# Altium schematic sheet JacdacPowerUsbC4PortShared 31.SchDoc: complete design
size A3; DocumentNumber: 1; SheetNumber: 1; SheetTotal: 1; VersionControl_RevNumber: 1
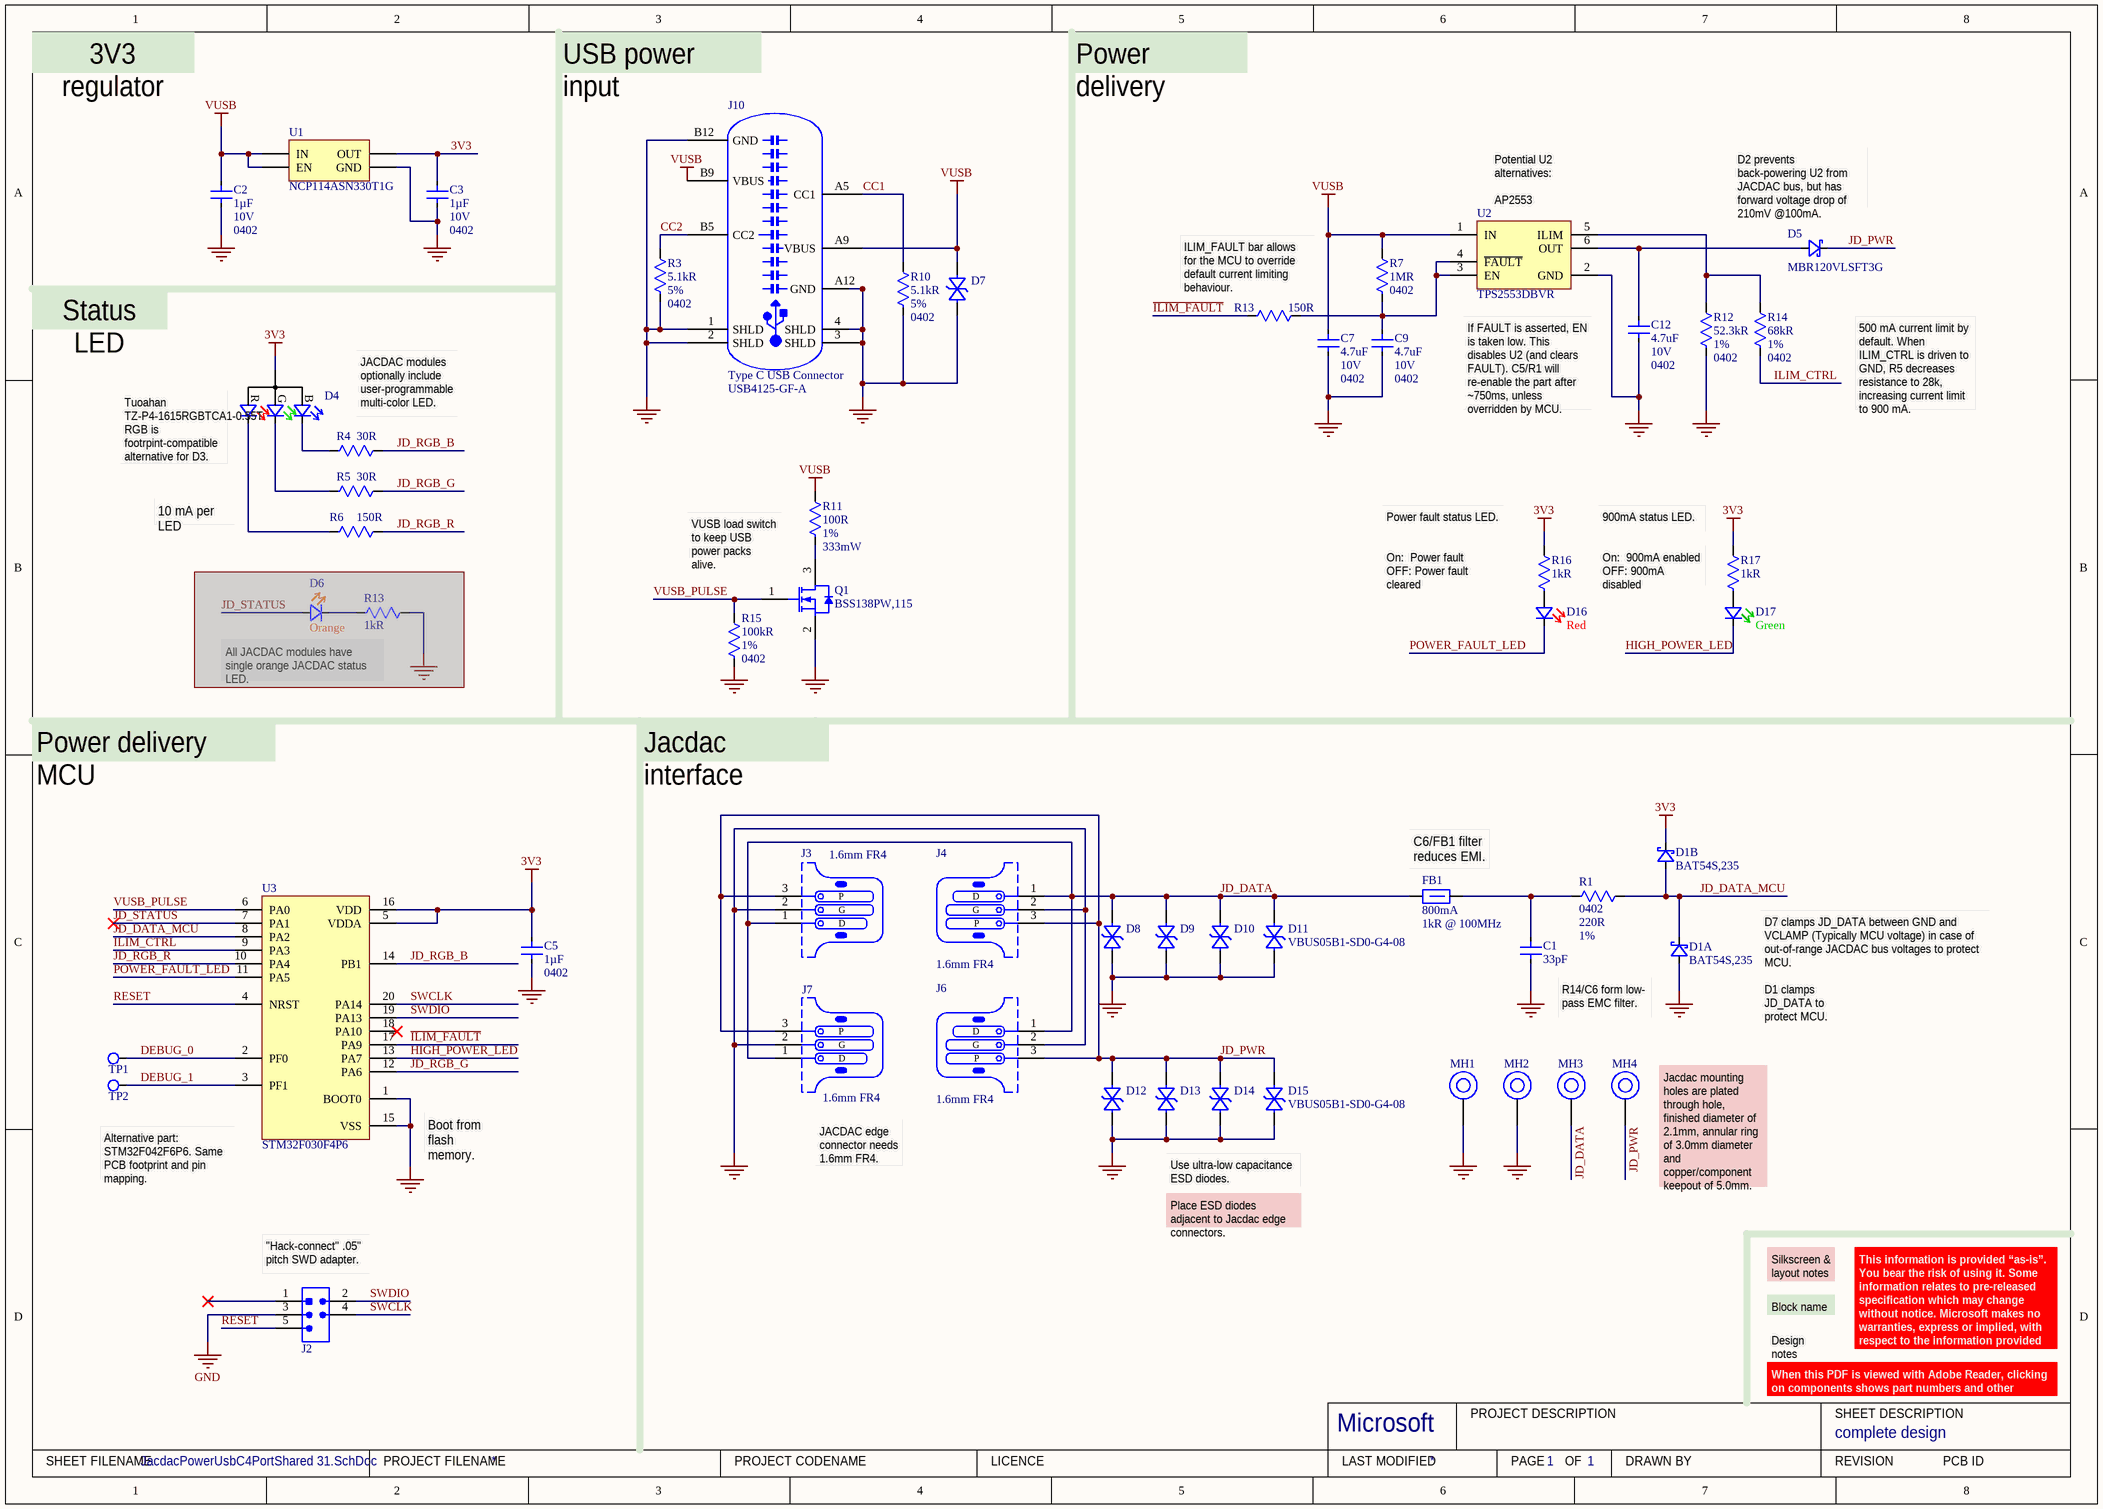
[diagram p0: JacdacPowerUsbC4PortShared 31.SchDoc]

## Parts
(Parts that share a designator on the sheet are numbered #1, #2 ... from top to bottom, then left to right.)
C1  Capacitance: 33pF  [C0402_0.55MM - without outline]  (hidden comment: CL05C330JB51PNC)
C2  Capacitance: 1µF  Voltage Rating: 10V  Case Code (Imperial): 0402  [C0402_0.55MM - without outline]  (hidden comment: CL05A105KP5NNNC)
C3  Capacitance: 1µF  Voltage Rating: 10V  Case Code (Imperial): 0402  [C0402_0.55MM - without outline]  (hidden comment: CL05A105KP5NNNC)
C5  Capacitance: 1µF  Case Code (Imperial): 0402  [C0402_0.55MM - without outline]  (hidden comment: CL05A105KP5NNNC)
C7  Capacitance: 4.7uF  Voltage Rating: 10V  Case Code (Imperial): 0402  [R0402 - Without outline]  (hidden comment: CL05A475MP5NRNC)
C9  Capacitance: 4.7uF  Voltage Rating: 10V  Case Code (Imperial): 0402  [R0402 - Without outline]  (hidden comment: CL05A475MP5NRNC)
C12  Capacitance: 4.7uF  Voltage Rating: 10V  Case Code (Imperial): 0402  [R0402 - Without outline]  (hidden comment: CL05A475MP5NRNC)
D1  Manufacturer Part Number: BAT54S,235  [NXP-BAT54S-TO-236AB - without outline]  (hidden comment: BAT54S)  (parts A,B of 2)
D4  HSMF-C114  [HSMF-C114]  (value not drawn)
D5  MBR120VLSFT3G  [MBR120VLSFT3G]
D6  Colour: Orange  [Rohm SML-D12 Orange - without outline]  (hidden comment: SML-D12D)  (masked out: inside a compile mask, not in the netlist)
D7  VBUS05B1-SD0-G4-08  [0201-VBUS05B1-SD0-G4-08 - Without outline]  (value not drawn)
D8  VBUS05B1-SD0-G4-08  [0201-VBUS05B1-SD0-G4-08 - Without outline]  (value not drawn)
D9  VBUS05B1-SD0-G4-08  [0201-VBUS05B1-SD0-G4-08 - Without outline]  (value not drawn)
D10  VBUS05B1-SD0-G4-08  [0201-VBUS05B1-SD0-G4-08 - Without outline]  (value not drawn)
D11  VBUS05B1-SD0-G4-08  [0201-VBUS05B1-SD0-G4-08 - Without outline]
D12  VBUS05B1-SD0-G4-08  [0201-VBUS05B1-SD0-G4-08 - Without outline]  (value not drawn)
D13  VBUS05B1-SD0-G4-08  [0201-VBUS05B1-SD0-G4-08 - Without outline]  (value not drawn)
D14  VBUS05B1-SD0-G4-08  [0201-VBUS05B1-SD0-G4-08 - Without outline]  (value not drawn)
D15  VBUS05B1-SD0-G4-08  [0201-VBUS05B1-SD0-G4-08 - Without outline]
D16  Colour: Red  [Rohm SML-D12 Red - without outline]  (hidden comment: SML-D12U)
D17  Colour: Green  [Rohm SML-D12 Green - without outline]  (hidden comment: SML-D12P)
FB1  Current Rating: 800mA  Impedance: 1kR @ 100MHz  [TDK MPZ1608 0.8mm - without outline]  (hidden comment: TDK MPZ1608S102ATA00)
J2  Hack Connect Mini 1.27 mm pitch 2-row  [HACK_CONNECT_MINI_5_X_1_27]  (value not drawn)  (no BOM)
J3  PCB Type: 1.6mm FR4  [JACDAC_EDGE_CONNECTOR]  (hidden comment: 3 pin jacdac edge connector)  (no BOM)
J4  PCB Type: 1.6mm FR4  [JACDAC_EDGE_CONNECTOR]  (hidden comment: 3 pin jacdac edge connector)  (no BOM)
J6  PCB Type: 1.6mm FR4  [JACDAC_EDGE_CONNECTOR]  (hidden comment: 3 pin jacdac edge connector)  (no BOM)
J7  PCB Type: 1.6mm FR4  [JACDAC_EDGE_CONNECTOR]  (hidden comment: 3 pin jacdac edge connector)  (no BOM)
J10  Type C USB Connector  [USB4125-GF-A]
MH1  MH_5.0MMK_3.0MMC_2.1MMD_PTH  [MH_5.0MMK_3.0MMC_2.1MMD_PTH]  (value not drawn)  (no BOM)
MH2  MH_5.0MMK_3.0MMC_2.1MMD_PTH  [MH_5.0MMK_3.0MMC_2.1MMD_PTH]  (value not drawn)  (no BOM)
MH3  MH_5.0MMK_3.0MMC_2.1MMD_PTH  [MH_5.0MMK_3.0MMC_2.1MMD_PTH]  (value not drawn)  (no BOM)
MH4  MH_5.0MMK_3.0MMC_2.1MMD_PTH  [MH_5.0MMK_3.0MMC_2.1MMD_PTH]  (value not drawn)  (no BOM)
Q1  BSS138PW,115  [SOT323 - without_outline]
R1  Case Code (Imperial): 0402  Resistance: 220R  Tolerance: 1%  [R0402 - Without outline]  (hidden comment: RC0402FR-07220RL)
R3  Resistance: 5.1kR  Tolerance: 5%  Case Code (Imperial): 0402  [R0402 - Without outline]  (hidden comment: RC0402JR-075K1L)
R4  Resistance: 30R  [R0402 - Without outline]  (hidden comment: RC0402FR-0730RL)
R5  Resistance: 30R  [R0402 - Without outline]  (hidden comment: RC0402FR-0730RL)
R6  Resistance: 150R  [R0402 - Without outline]  (hidden comment: RC0402FR-07150RL)
R7  Resistance: 1MR  Case Code (Imperial): 0402  [R0402 - Without outline]
R10  Resistance: 5.1kR  Tolerance: 5%  Case Code (Imperial): 0402  [R0402 - Without outline]  (hidden comment: RC0402JR-075K1L)
R11  Resistance: 100R  Tolerance: 1%  Max Power Dissipation: 333mW  [RES0805]  (hidden comment: CRGP0805F100R)
R12  Resistance: 52.3kR  Tolerance: 1%  Case Code (Imperial): 0402  [R0402 - Without outline]  (hidden comment: RC0402FR-0752K3L)
R13#1  Resistance: 150R  [R0402 - Without outline]  (hidden comment: RC0402FR-07150RL)
R13#2  Resistance: 1kR  [R0402 - Without outline]  (hidden comment: RC0402FR-071KL)  (masked out: inside a compile mask, not in the netlist)
R14  Resistance: 68kR  Tolerance: 1%  Case Code (Imperial): 0402  [R0402 - Without outline]  (hidden comment: RT0402FRE0768KL)
R15  Resistance: 100kR  Tolerance: 1%  Case/Package: 0402  [R0402 - Without outline]  (hidden comment: RC0402FR-07100KL)
R16  Resistance: 1kR  [R0402 - Without outline]  (hidden comment: RC0402FR-071KL)
R17  Resistance: 1kR  [R0402 - Without outline]  (hidden comment: RC0402FR-071KL)
TP1  TestPoint  [Pad1.27mm]  (value not drawn)  (no BOM)
TP2  TestPoint  [Pad1.27mm]  (value not drawn)  (no BOM)
U1  LDO 3.3V/300 mA  [ON_SEMI-SOT23-5 - without outline]  (value not drawn)
U2  TPS2553DBVR  [TI-TPS2553 - without_outline]
U3  STM32F030F4P6  [20-TSSOP - without outline]

## Nets
3V3: C3.2 C5.2 D1.2(K) D4.1(A) R16.1 R17.1 U1.5(OUT) U3.5(VDDA) U3.16(VDD)
GND: C1.1 C2.1 C3.1 C5.1 C7.1 C9.1 C12.1 D1.1(A) D7.2(A) D8.2(A) D9.2(A) D10.2(A) D11.2(A) D12.2(A) D13.2(A) D14.2(A) D15.2(A) J2.3(GND) J3.2(G) J4.2(G) J6.2(G) J7.2(G) J10.1(SHLD) J10.2(SHLD) J10.3(SHLD) J10.4(SHLD) J10.A12(GND) J10.B12(GND) MH1.1 MH2.1 Q1.2(S) R3.2 R10.2 R12.1 R15.1 U1.2(GND) U2.2(GND) U3.1(BOOT0) U3.15(VSS)
VUSB: C2.2 C7.2 D7.1(K) J10.A9(VBUS) J10.B9(VBUS) R7.1 R11.2 U1.1(IN) U1.3(EN) U2.1(IN)
~{ILIM_FAULT}: R13#1.1 U3.17(PA9)
CC1: J10.A5(CC1) R10.1
CC2: J10.B5(CC2) R3.1
DEBUG_0: TP1.1 U3.2(PF0)
DEBUG_1: TP2.1 U3.3(PF1)
HIGH_POWER_LED: D17.1(K) U3.13(PA7)
ILIM_CTRL: R14.1 U3.9(PA3)
JD_DATA: D8.1(K) D9.1(K) D10.1(K) D11.1(K) FB1.1 J3.1(D) J4.1(D) J6.1(D) J7.1(D) MH3.1
JD_DATA_MCU: D1.3(K) R1.1 U3.8(PA2)
JD_PWR: D5.1(K) D12.1(K) D13.1(K) D14.1(K) D15.1(K) J3.3(P) J4.3(P) J6.3(P) J7.3(P) MH4.1
JD_RGB_B: R4.2 U3.14(PB1)
JD_RGB_G: R5.2 U3.12(PA6)
JD_RGB_R: R6.2 U3.10(PA4)
JD_STATUS: U3.7(PA1)
POWER_FAULT_LED: D16.1(K) U3.11(PA5)
RESET: J2.5(RESET) U3.4(NRST)
SWCLK: J2.4(SWCLK) U3.20(PA14)
SWDIO: J2.2(SWDIO) U3.19(PA13)
VUSB_PULSE: Q1.1(G) R15.2 U3.6(PA0)
NetC1_2: C1.2 FB1.2 R1.2
NetC9_2: C9.2 R7.2 R13#1.2 U2.3(EN) U2.4(~{FAULT})
NetC12_2: C12.2 D5.2(A) U2.6(OUT)
NetD4_2: D4.2(R) R6.1
NetD4_3: D4.3(G) R5.1
NetD4_4: D4.4(B) R4.1
NetD16_2: D16.2(A) R16.2
NetD17_2: D17.2(A) R17.2
NetQ1_3: Q1.3(D) R11.1
NetR12_2: R12.2 R14.2 U2.5(ILIM)

Not connected (* = marked no-connect by the designer): J2 1(VCC)*; U3 18(PA10)*

## Notes on the sheet
- 3V3 regulator
- USB power input
- Power delivery
- (near U2) Potential U2 alternatives:
  AP2553
- (near D5) D2 prevents back-powering U2 from JACDAC bus, but has forward voltage drop of 210mV @100mA.
- (near R13#1) ILIM_FAULT bar allows for the MCU to override default current limiting behaviour.
- Status LED
- JACDAC modules optionally include user-programmable multi-color LED.
- If FAULT is asserted, EN is taken low. This disables U2 (and clears FAULT). C5/R1 will re-enable the part after ~750ms, unless overridden by MCU.
- 500 mA current limit by default. When ILIM_CTRL is driven to GND, R5 decreases resistance to 28k, increasing current limit to 900 mA.
- (near D4) Tuoahan TZ-P4-1615RGBTCA1-0.55T RGB is footrpint-compatible alternative for D3.
- 10 mA per LED
- VUSB load switch to keep USB power packs alive.
- (near R16) Power fault status LED.
- On:  Power fault                  OFF: Power fault cleared
- (near R17) 900mA status LED.
- On:  900mA enabled     OFF: 900mA disabled
- All JACDAC modules have single orange JACDAC status LED.
- Power delivery MCU
- Jacdac interface
- (near FB1) C6/FB1 filter reduces EMI.
- D7 clamps JD_DATA between GND and VCLAMP (Typically MCU voltage) in case of out-of-range JACDAC bus voltages to protect MCU.
- R14/C6 form low-
  pass EMC filter.
- D1 clamps JD_DATA to protect MCU.
- Alternative part: STM32F042F6P6. Same PCB footprint and pin mapping.
- Boot from flash memory.
- JACDAC edge connector needs 1.6mm FR4.
- Use ultra-low capacitance ESD diodes.
- (near MH4) Jacdac mounting holes are plated through hole, finished diameter of 2.1mm, annular ring of 3.0mm diameter and copper/component keepout of 5.0mm.
- Place ESD diodes adjacent to Jacdac edge connectors.
- (near J2) "Hack-connect" .05" pitch SWD adapter.
- Block name
- Silkscreen & layout notes
- Design notes
- When this PDF is viewed with Adobe Reader, clicking on components shows part numbers and other details.
- This information is provided “as-is”. You bear the risk of using it. Some information relates to pre-released specification which may change without notice. Microsoft makes no warranties, express or implied, with respect to the information provided here.
- Microsoft
- PROJECT DESCRIPTION
- SHEET DESCRIPTION
- SHEET FILENAME
- PROJECT FILENAME
- PROJECT CODENAME
- LICENCE
- LAST MODIFIED
- PAGE
- OF
- DRAWN BY
- REVISION
- PCB ID

## Library data of the parts
C1 = CL05C330JB51PNC: CAP CER 33PF 50V NP0 0402; Manufacturer: Samsung; Tolerance: 5%; Supplier 1: Digi-Key; Manufacturer Part Number: CL05C330JB51PNC; RoHS: Yes; Category: Capacitors; Stock 1: 250654; Pricing 1: 1=0.10000, 10=0.07500, 50=0.04060, 100=0.03320, 500=0.02374, 1000=0.01865, 2500=0.01696, 5000=0.01560 (USD); Mount: Surface Mount; Case/Package: 0402; Case Code (Metric): 1005; Min Operating Temperature: -55°C; Max Operating Temperature: 125°C; Packaging: Tape and Reel; Length: 0.039inch; Width: 0.02inch; Thickness: 0.022inch; Ratings: AEC-Q200; Lead Free: Lead Free; ComponentLink1URL: http://www.samsungsem.com/kr/support/library/product-catalog/mlcc.jsp; ComponentLink1Description: Samsung datasheet online; Supplier 2: Mouser; Stock 2: 97900; Pricing 2: 1=0.11000, 10=0.08200, 100=0.03600, 500=0.02600, 1000=0.02000, 2500=0.01800 (USD); Supplier 3: Future Electronics; Stock 3: 100000; Pricing 3: 10000=0.00780 (USD); Supplier Part Number 3: 6022520; Supplier Part Number 2: 187-CL05C330JB51PNC; Checked: ?; Created: DG; Supplier Part Number 1: 1276-6515-1-ND; Voltage Rating: 50V; Case Code (Imperial): 0402
C2 C3 C5 = CL05A105KP5NNNC: CAP CER 1UF 10V X5R 0402; Manufacturer: Samsung; Material: Ceramic; Tolerance: 10%; Supplier 1: Digi-Key; Manufacturer Part Number: CL05A105KP5NNNC; RoHS: Yes; Category: Capacitors; Stock 1: 5705569; Pricing 1: 1=0.10000, 10=0.03900, 50=0.02100, 100=0.01720, 500=0.01228, 1000=0.00965, 2500=0.00877, 5000=0.00807 (USD); Mount: Surface Mount; Case/Package: 0402; Case Code (Metric): 1005; Contact Plating: Tin; Min Operating Temperature: -55°C; Max Operating Temperature: 85°C; Dielectric: X5R; Package Quantity: 1; Packaging: Tape and Reel; Length: 1mm; Height: 0.5mm; Width: 0.02inch; Thickness: 0.022inch; Depth: 0.5mm; Radiation Hardening: No; ComponentLink1URL: https://datasheet.ciiva.com/15195/getdatasheetpartid-358390-15195630.pdf; ComponentLink1Description: Online datasheet; Supplier 2: Mouser; Stock 2: 928941; Pricing 2: 1=0.10000, 10=0.04200, 100=0.01800, 500=0.01300, 1000=0.01000, 2500=0.00900 (USD); Supplier 3: Farnell; Stock 3: 53670; Pricing 3: 10=0.02450, 100=0.02000, 500=0.01310, 2500=0.00920, 5000=0.00810, 10000=0.00640, 50000=0.00490 (GBP); Supplier Part Number 3: 3013329; Supplier Part Number 2: 187-CL05A105KP5NNNC; Supplier Part Number 1: 1276-1076-1-ND; Created: DG; Checked: ?
  C5: Voltage Rating: 10V
C7 C9 C12 = CL05A475MP5NRNC: CAP CER 4.7UF 10V X5R 0402; Manufacturer: Samsung; Tolerance: 20%; Supplier 1: Digi-Key; Manufacturer Part Number: CL05A475MP5NRNC; RoHS: Yes; Category: Ceramic Capacitors; Stock 1: 840000; Pricing 1: 10000=0.01405, 20000=0.01338 (USD); Mount: Surface Mount; Case/Package: 0402; Case Code (Metric): 1005; Min Operating Temperature: -55°C; Max Operating Temperature: 85°C; Package Quantity: 10000; Packaging: Tape and Reel; Dielectric: X5R; Series: CL; Length: 0.039inch; Width: 0.02inch; Thickness: 0.022inch; Lead Free: Lead Free; RoHS Compliant: Yes; ComponentLink1URL: https://datasheet.ciiva.com/25786/cl05a475mp5nrnc-25786963.pdf; ComponentLink1Description: Online datasheet; Supplier 2: Future Electronics; Stock 2: 2004; Pricing 2: 1=0.23500, 500=0.03970, 1500=0.02900, 2500=0.02500, 5000=0.02050 (USD); Created By: D. Gakure; Checked By: ?; Supplier Part Number 2: 2103694; Supplier Part Number 1: 1276-1482-2-ND
D1 = BAT54S: DIODE ARRAY SCHOTTKY 30V SOT23; Manufacturer: Nexperia; Supplier 1: Digi-Key; RoHS: No; Category: Rectifier Diodes; Stock 1: 14011; Pricing 1: 1=0.13000, 10=0.11900, 100=0.05610, 500=0.03326, 1000=0.02185, 5000=0.02138 (USD); ComponentLink1URL: https://assets.nexperia.com/documents/data-sheet/BAT54_SER.pdf; ComponentLink1Description: NXP datasheet online; Supplier 2: Mouser; Supplier 3: RSComponents; Supplier Part Number 2: 771-BAT54S235; Supplier Part Number 3: 1707990; Supplier Part Number 1: 1727-1868-1-ND
D4 = HSMF-C114: Red, Green, Blue (RGB) 626nm Red, 525nm Green, 470nm Blue LED Indication - Discrete 1.9V Red, 3.4V Green, 3.4V Blue 0606 (1616 Metric); Manufacturer: Broadcom Avago; Color: Blue,Green,Red; Lens Color: White; Viewing Angle: 145°; Luminous Intensity: 70mcd; Lens Style: Diffused,Rectangular; Forward Current: 20mA; Lens Transparency: Diffused; Number of Elements: 3; Reverse Voltage: 5V; Power Rating: 78mW; Supplier 1: Digi-Key; Manufacturer Part Number: HSMF-C114; RoHS: Yes; Category: Optoelectronics; Stock 1: 20555; Pricing 1: 1=1.78000, 10=1.12500, 100=0.83250, 500=0.76500, 1000=0.63000, 2000=0.59850 (USD); Mount: Surface Mount; Case/Package: 0606; Number of Pins: 4; Case Code (Metric): 1616; Case Code (Imperial): 0606; Min Operating Temperature: -40°C; Max Operating Temperature: 85°C; Forward Voltage: 3.4V; Packaging: Tape and Reel; Wavelength: 470nm; Package Quantity: 4000; Dominant Wavelength: 470nm; Test Current: 20mA; Number of LEDs: 3; Length: 1.6mm; Width: 1.5mm; Height: 0.35mm; Depth: 1.6mm; Radiation Hardening: No; REACH SVHC: No SVHC; Lead Free: Lead Free; Supplier 2: Farnell; Stock 2: 8134; Pricing 2: 1=1.56000, 10=0.97100, 25=0.87800, 50=0.78500, 100=0.69200, 500=0.60500 (GBP); Supplier 3: Mouser; Stock 3: 14991; Pricing 3: 1=1.69000, 10=1.13000, 50=1.13000, 100=0.85600, 1000=0.74800, 10000=0.74800 (USD); Supplier Part Number 1: 516-1795-1-ND; Supplier Part Number 3: 630-HSMF-C114; Supplier Part Number 2: 1058362; ComponentLink1Description: Online datasheet; ComponentLink1URL: https://docs.broadcom.com/docs/AV02-2451EN; Created By: D. Gakure; Checked By: ?
D5 = MBR120VLSFT3G: DIODE SCHOTTKY 20V 1A SOD123FL; Manufacturer: ON Semiconductor; Max Surge Current: 45A; Forward Voltage: 340mV; Peak Reverse Current: 600uA; Element Configuration: Single; Polarity: Standard; Supplier 1: Digi-Key; RoHS: Yes; Category: Schottky Diodes; Stock 1: 32481; Pricing 1: 1=0.39000, 10=0.28600, 100=0.19920, 500=0.12616, 1000=0.10292, 2000=0.09960, 5000=0.09628 (USD); Number of Pins: 2; Min Operating Temperature: -65°C; Max Operating Temperature: 125°C; Package Quantity: 10000; Forward Current: 1A; Packaging: Tape and Reel; Max Reverse Leakage Current: 600uA; Average Rectified Current: 1A; Peak Non-Repetitive Surge Current: 45A; Max Repetitive Reverse Voltage (Vrrm): 20V; Max Forward Surge Current (Ifsm): 45A; Voltage Rating (DC): 20V; Current Rating: 1A; Output Current: 1A; Max Reverse Voltage (DC): 20V; Radiation Hardening: No; REACH SVHC: No SVHC; Lead Free: Lead Free; Halogen Free: Halogen Free; ComponentLink4URL: https://datasheet.ciiva.com/6380/mbr120vlsft1-d-6380910.pdf; ComponentLink4Description: On Semi datasheet online; Supplier 2: Mouser; Supplier 3: RSComponents; Supplier Part Number 3: 1867479; Supplier Part Number 2: 863-MBR120VLSFT3G; Supplier Part Number 1: MBR120VLSFT3GOSCT-ND; Manufacturer Part Number: MBR120VLSFT3G
D6 = SML-D12D: 1.6 x 0.8 x 0.55mm (0603) LED 605nm Orange; Manufacturer: Rohm Semiconductor; Manufacturer Part Number: SML-D12D8WT86; Millicandela Rating: 100mcd; Voltage - Forward (Vf) (Typ): 2.2V; Current - Test: 20mA; Lens Type: Diffused, White; Lens Style/Size: Rectangle with Flat Top, 1.2mm x 0.8mm; Supplier 1: Digi-Key; RoHS: RoHS Compliant; Category: Optoelectronics; Stock 1: 1719; Pricing 1: 1=0.38, 10=0.279, 25=0.2232, 100=0.1478, 250=0.1046, 500=0.08926, 1000=0.06974 (GBP); Packaging: Cut Tape (CT); Wavelength - Dominant: 605nm; Wavelength - Peak: -; Viewing Angle: -; Package / Case: 0603 (1608 Metric); Size / Dimension: 1.60mm L x 0.80mm W; Height: 0.55mm; Mounting Type: Surface Mount; Luminous Flux @ Current - Test: -; ComponentLink1URL: https://d1d2qsbl8m0m72.cloudfront.net/en/products/databook/datasheet/opto/led/chip_mono/sml-d12x8_d13x8-e.pdf; ComponentLink1Description: Online datasheet; Supplier Part Number 1: 511-1577-1-ND
D7-D15 = VBUS05B1-SD0-G4-08: TVS DIODE 5.5V 18V CLP0603; Manufacturer: Vishay Semiconductors; Peak Pulse Current: 2.5A; Number of Bidirectional Channels: 1; Min Breakdown Voltage: 6V; Peak Pulse Power: 45W; Power Line Protection: No; Direction: Bidirectional; Capacitance: 0.4pF; Element Configuration: Single; Supplier 1: Digi-Key; RoHS: Yes; Category: TVS Diodes; Stock 1: 22028; Pricing 1: 1=0.27000, 10=0.18500, 100=0.09020, 500=0.07524, 1000=0.05228, 2000=0.04531, 5000=0.04203 (USD); Mount: Surface Mount; Case/Package: 0201; Number of Pins: 2; Case Code (Metric): 0603; Case Code (Imperial): 0201; Min Operating Temperature: -55°C; Max Operating Temperature: 150°C; Packaging: Tape and Reel; Reverse Standoff Voltage: 5.5V; Clamping Voltage: 18V; Working Voltage: 5.5V; Resistor Type: Zener; ComponentLink2URL: http://www.vishay.com/docs/85899/vbus05b1-sd0.pdf; ComponentLink2Description: Online datasheet; Supplier 2: Farnell; Stock 2: 13100; Pricing 2: 5=0.20800, 10=0.14000, 100=0.06340, 500=0.05020, 1000=0.04160, 5000=0.03300 (GBP); Supplier 3: Mouser; Stock 3: 1209; Pricing 3: 1=0.27000, 10=0.18500, 50=0.18500, 100=0.09300, 1000=0.03900, 10000=0.03400 (USD); Supplier 4: Arrow Electronics; Stock 4: 719; Pricing 4: 1=0.17630, 10=0.14370, 25=0.14230, 100=0.07810, 250=0.07660, 500=0.06310, 15000=0.02980, 150000=0.02970, 1500000=0.02870, 7500000=0.02800 (USD); Supplier Part Number 4: VBUS05B1-SD0-G4-08; Supplier Part Number 3: 78-VBUS05B1SD0-G4-08; Supplier Part Number 1: VBUS05B1-SD0-G4-08GICT-ND; Supplier Part Number 2: 2932858; Created By: D. Gakure; Checked By: ?; Manufacturer Part Number: VBUS05B1-SD0-G4-08
D16 = SML-D12U: 1.6 x 0.8 x 0.55mm (0603) LED 620nm Red; Manufacturer: Rohm Semiconductor; Manufacturer Part Number: SML-D12U8WT86; Millicandela Rating: 63mcd; Voltage - Forward (Vf) (Typ): 2.2V; Current - Test: 20mA; Lens Type: Diffused, White; Lens Style/Size: Rectangle with Flat Top, 1.2mm x 0.8mm; Supplier 1: Digi-Key; RoHS: RoHS Compliant; Category: Optoelectronics; Stock 1: 5722; Pricing 1: 1=0.38, 10=0.279, 25=0.2232, 100=0.1478, 250=0.1046, 500=0.08926, 1000=0.06974 (GBP); Packaging: Cut Tape (CT); Wavelength - Dominant: 620nm; Wavelength - Peak: -; Viewing Angle: -; Package / Case: 0603 (1608 Metric); Size / Dimension: 1.60mm L x 0.80mm W; Height: 0.55mm; Mounting Type: Surface Mount; Luminous Flux @ Current - Test: -; ComponentLink1URL: https://d1d2qsbl8m0m72.cloudfront.net/en/products/databook/datasheet/opto/led/chip_mono/sml-d12x8_d13x8-e.pdf; ComponentLink1Description: Online datasheet; Supplier 2: Farnell; Supplier Part Number 1: 511-1580-1-ND; Supplier Part Number 2: 1685094
D17 = SML-D12P: 1.6 x 0.8 x 0.55mm (0603) LED 560nm Green; Manufacturer: Rohm Semiconductor; Manufacturer Part Number: SML-D12P8WT86; Millicandela Rating: 6.3mcd; Voltage - Forward (Vf) (Typ): 2.2V; Current - Test: 20mA; Lens Type: Diffused, White; Lens Style/Size: Rectangle with Flat Top, 1.2mm x 0.8mm; Supplier 1: Digi-Key; RoHS: RoHS Compliant; Category: Optoelectronics; Stock 1: 19305; Pricing 1: 1=0.38, 10=0.279, 25=0.2232, 100=0.1478, 250=0.1046, 500=0.08926, 1000=0.06974 (GBP); Packaging: Cut Tape (CT); Wavelength - Dominant: 560nm; Wavelength - Peak: -; Viewing Angle: -; Package / Case: 0603 (1608 Metric); Size / Dimension: 1.60mm L x 0.80mm W; Height: 0.55mm; Mounting Type: Surface Mount; Luminous Flux @ Current - Test: -; ComponentLink1URL: https://d1d2qsbl8m0m72.cloudfront.net/en/products/databook/datasheet/opto/led/chip_mono/sml-d12x8_d13x8-e.pdf; ComponentLink1Description: Online datasheet; Supplier Part Number 1: 511-1579-1-ND
FB1 = TDK MPZ1608S102ATA00: 0603 1k@100MHz 0.8A chip; Core Material: Ferrite; Tolerance: 25%; DC Resistance (DCR): 300mR; Supplier 1: Digi-Key; Stock 1: 113542; Pricing 1: 1=0.1, 10=0.079, 25=0.0716, 50=0.0644, 100=0.0472, 250=0.03432, 500=0.03146, 1000=0.02717 (USD); Mount: Surface Mount; Case/Package: 0603; Case Code (Metric): 1608; Case Code (Imperial): 0603; Package Quantity: 4000; Packaging: Tape and Reel; Max DC Current: 800mA; Length: 0.063inch; Height: 0.037inch; Width: 0.031inch; ComponentLink2URL: https://www.mouser.co.uk/datasheet/2/400/eads_commercial_power_mpz1608_en-923650.pdf; ComponentLink2Description: datasheet online; Supplier 2: Mouser; ComponentLink3Description: datasheet; ComponentLink3URL: Y:\System\Altium\Libraries 2014\TDK\Datasheets\eads_commercial_power_mpz1608_en-923650.pdf; Supplier Part Number 1: 445-8694-1-ND; Supplier Part Number 2: 810-MPZ1608S102ATA00; Manufacturer: TDK; Manufacturer Part Number: MPZ1608S102ATA00
J2 = HACK_CONNECT_MINI
J3 J4 J6 J7 = JACDAC edge connector: 3 pin jacdac edge connector 1.27mm pitch; Checked By: ?; Created By: D. Gakure; Manufacturer Part Number: JACDAC_EDGE_CONNECTOR; ComponentLink1Description: JACDAC PCB edge connector spec onlin; ComponentLink1URL: https://github.com/microsoft/jacdac-mdk/blob/main/connector/JACDAC_PCB_Edge_Connector_Drawing_JD-PEC-01_rev_01.pdf; ComponentLink2Description: Yuliang JACDAC cable connector drawing online; ComponentLink2URL: https://github.com/microsoft/jacdac-mdk/blob/main/connector/JACDAC-Connector-by-Yuliang-2020-11-28.pdf
J10 = USB4125-GF-A: USB-C (USB TYPE-C) USB 2.0 Receptacle Connector 24 (6+18 Dummy) Position Surface Mount, Right Angle; Through Hole; Manufacturer 1: Global Connector Technology; Manufacturer: GCT; Supplier 1: Digi-Key; RoHS: No; ComponentLink1Description: Datasheet online; ComponentLink1URL: https://gct.co/files/drawings/usb4125.pdf; Supplier Part Number 1: 2073-USB4125-GF-ACT-ND; Manufacturer Part Number 1: USB4125-GF-A; ComponentLink2Description: Datasheet offline; ComponentLink2URL: Y:\System\Altium\Libraries 2014\GCT\Datasheets\usb4125.pdf; ComponentLink3Description: Digi-Key order link; ComponentLink3URL: https://www.digikey.co.uk/product-detail/en/gct/USB4125-GF-A/2073-USB4125-GF-ATR-ND/13547388; Supplier 2: Farnell; Manufacturer Part Number: USB4125-GF-A; Supplier Part Number 2: 3595674
MH1-MH4 = MH_5.0MMK_3.0MMC_2.1MMD_PTH: Mounting Hole 5.0mm keepout, 3.0mm annualar ring and 2.1mm Drill PTH
Q1 = BSS138PW,115: NEXPERIA - BSS138PW,115 - N CHANNEL MOSFET, TRENCH, 60V, 320MA, SOT-323, FULL REEL; Supplier 1: Digi-Key; Manufacturer: Nexperia; RoHS: No; Category: Semiconductor; Stock 1: 324409; Pricing 1: 1=0.22000, 10=0.18300, 25=0.15320, 100=0.07480, 500=0.06240, 1000=0.04335 (USD); ComponentLink3URL: https://assets.nexperia.com/documents/data-sheet/BSS138PW.pdf; ComponentLink3Description: Online datasheet; Supplier 2: Mouser; Stock 2: 48036; Pricing 2: 1=0.32000, 10=0.15400, 100=0.07400, 500=0.06300, 1000=0.04400, 3000=0.03400, 9000=0.02800, 45000=0.02300 (USD); Supplier 3: Farnell; Stock 3: 72681; Supplier Part Number 3: 1907611; Supplier Part Number 2: 771-BSS138PW115; Supplier Part Number 1: 1727-1143-6-ND; Pricing 3: 5=0.14100, 25=0.10400, 100=0.06600, 250=0.05850, 500=0.05090, 1000=0.02760, 5000=0.02330 (GBP); Created: DG; Checked: ?; Manufacturer Part Number: BSS138PW,115
R1 = RC0402FR-07220RL: RES SMD 220 OHM 1% 1/16W 0402; Manufacturer: Yageo; Power Rating: 62.5mW; Voltage Rating: 50V; Temperature Coefficient: 100ppm/°C; Max Power Dissipation: 63mW; Supplier 1: Digi-Key; Manufacturer Part Number: RC0402FR-07220RL; RoHS: Yes; Category: Resistors; Stock 1: 1286042; Pricing 1: 1=0.10000, 10=0.01400, 100=0.00580, 1000=0.00262, 2500=0.00228, 5000=0.00188 (USD); Case/Package: 0402; Number of Pins: 2; Case Code (Metric): 1005; Min Operating Temperature: -55°C; Max Operating Temperature: 155°C; Packaging: Tape and Reel; Voltage Rating (DC): 50V; Package Quantity: 1; Termination: SMD/SMT; Resistor Type: Thick Film; Number of Terminations: 2; Features: Moisture Resistant; Length: 1mm; Height: 0.016inch; Width: 0.02inch; Depth: 0.5mm; REACH SVHC: No SVHC; Military Standard: Not; Lead Free: Lead Free; ComponentLink1URL: https://datasheet.ciiva.com/11819/0900766b80c66297-11819466.pdf?src-supplier=RSComponents; ComponentLink1Description: https://datasheet.ciiva.com/11819/0900766b80c66297-11819466.pdf?src-supplier=RSComponents; ComponentLink2URL: https://datasheet.ciiva.com/2453/pyu-r-int-thick-7-2453460.pdf?src-supplier=Digi-Key; ComponentLink2Description: https://datasheet.ciiva.com/2453/pyu-r-int-thick-7-2453460.pdf?src-supplier=Digi-Key; ComponentLink3URL: https://datasheet.ciiva.com/2453/pyu-r-int-thick-7-2453461.pdf?src-supplier=Digi-Key; ComponentLink3Description: https://datasheet.ciiva.com/2453/pyu-r-int-thick-7-2453461.pdf?src-supplier=Digi-Key; ComponentLink4URL: https://datasheet.ciiva.com/2453/pyu-r-int-thick-7-2453462.pdf?src-supplier=Digi-Key; ComponentLink4Description: https://datasheet.ciiva.com/2453/pyu-r-int-thick-7-2453462.pdf?src-supplier=Digi-Key; ComponentLink5URL: https://datasheet.ciiva.com/16746/pyu-rc0402-51-rohs-l-6-r-16746831.pdf?src-supplier=Future+Electronics; ComponentLink5Description: https://datasheet.ciiva.com/16746/pyu-rc0402-51-rohs-l-6-r-16746831.pdf?src-supplier=Future+Electronics; Supplier 2: Mouser; Stock 2: 324625; Pricing 2: 1=0.10000, 10=0.01200, 100=0.00400, 1000=0.00400, 2500=0.00400, 10000=0.00300 (USD); Supplier 3: Farnell; Stock 3: 18234; Pricing 3: 1=0.08130, 25=0.01210, 100=0.01120, 250=0.01030, 500=0.00900 (GBP); Supplier Part Number 3: 2147864; Supplier Part Number 2: 603-RC0402FR-07220RL; Supplier Part Number 1: 311-220LRCT-ND; Created: D.G; Checked: ?
R3 R10 = RC0402JR-075K1L: RES SMD 5.1K OHM 5% 1/16W 0402; Manufacturer: Yageo; Voltage Rating: 50V; Power Rating: 62.5mW; Temperature Coefficient: 100ppm/°C; Max Power Dissipation: 63mW; Supplier 1: Digi-Key; Manufacturer Part Number: RC0402JR-075K1L; RoHS: Yes; Category: Chip SMD Resistors; Stock 1: 1270619; Pricing 1: 1=0.10000, 10=0.01300, 100=0.00520, 1000=0.00233, 2500=0.00202, 5000=0.00167 (USD); Case/Package: 0402; Case Code (Metric): 1005; Weight: 2.3E-05oz; Size Code: 0402; Min Operating Temperature: -55°C; Max Operating Temperature: 155°C; Packaging: Tape and Reel; Resistor Type: Thick Film; Termination: SMD/SMT; Voltage Rating (DC): 50V; Features: Moisture Resistant; Series: RC; Number of Terminations: 2; Construction: Rectangular; Resistance Tolerance: 5%; Length: 1mm; Width: 0.5mm; Height: 0.35mm; Depth: 0.5mm; REACH SVHC: No SVHC; Military Standard: Not; Lead Free: Lead Free; RoHS Compliant: Yes; ComponentLink2URL: https://datasheet.ciiva.com/16740/pyu-rc0402-51-rohs-l-6-r-16740925.pdf; ComponentLink2Description: Onnline datasheet; Supplier 2: Newark; Stock 2: 1265; Pricing 2: 1=0.10000, 25=0.01000, 100=0.00400, 250=0.00400, 500=0.00300, 1000=0.00300 (USD); Supplier 3: Mouser; Stock 3: 100817; Pricing 3: 1=0.10000, 10=0.01000, 50=0.01000, 100=0.00400, 1000=0.00300, 10000=0.00200 (USD); Supplier 4: Farnell; Stock 4: 68890; Pricing 4: 10=0.00910, 100=0.00390, 500=0.00320, 2500=0.00240, 5000=0.00210, 10000=0.00190, 50000=0.00150 (GBP); Supplier 5: Farnell; Stock 5: 1265; Pricing 5: 10000=0.00270 (GBP); Supplier Part Number 5: 1799293; Supplier Part Number 4: 3495714; Supplier Part Number 3: 603-RC0402JR-075K1L; Supplier Part Number 2: 68R0016; Supplier Part Number 1: 311-5.1KJRCT-ND; Created By: D. Gakure; Checked By: ?
R4 R5 = RC0402FR-0730RL: RES SMD 30 OHM 1% 1/16W 0402; Manufacturer: Yageo; Temperature Coefficient: 100ppm/°C; Power Rating: 63mW; Voltage Rating: 50V; Supplier 1: Digi-Key; Manufacturer Part Number: RC0402FR-0730RL; RoHS: Yes; Category: Chip SMD Resistors; Stock 1: 2973; Pricing 1: 1=0.10000, 10=0.01400, 100=0.00580, 1000=0.00260, 2500=0.00226, 5000=0.00186 (USD); Case/Package: 0402; Contact Plating: Tin,Matte; Case Code (Metric): 1005; Size Code: 0402; Min Operating Temperature: -55°C; Max Operating Temperature: 155°C; Resistor Type: Thick Film; Packaging: Tape and Reel; Termination: SMD/SMT; Voltage Rating (DC): 50V; Features: Moisture Resistant; Series: RC; Max Power Dissipation: 63mW; Number of Terminations: 2; Construction: Rectangular; Resistance Tolerance: 1%; Length: 1mm; Width: 0.5mm; Height: 0.35mm; Depth: 0.5mm; REACH SVHC: Unknown; Military Standard: Not; Lead Free: Lead Free; RoHS Compliant: Yes; ComponentLink1URL: https://datasheet.ciiva.com/7849/1018594-7849958.pdf; ComponentLink1Description: Online datasheet; Supplier 2: Mouser; Stock 2: 41804; Pricing 2: 1=0.10000, 10=0.01200, 50=0.01200, 100=0.00400, 1000=0.00400, 10000=0.00300 (USD); Supplier 3: Farnell; Stock 3: 4422; Pricing 3: 10=0.01210, 100=0.00420, 500=0.00370, 2500=0.00280, 5000=0.00250, 10000=0.00230, 50000=0.00150 (GBP); Supplier Part Number 3: 1458775; Supplier Part Number 2: 603-RC0402FR-0730RL; Supplier Part Number 1: 311-30LRCT-ND; Created By: D. Gakure; Checked By: ?; Tolerance: 1%; Case Code (Imperial): 0402
R6 R13#1 = RC0402FR-07150RL: RES SMD 150 OHM 1% 1/16W 0402; Manufacturer: Yageo; Power Rating: 62.5mW; Voltage Rating: 50V; Temperature Coefficient: 100ppm/°C; Max Power Dissipation: 63mW; Supplier 1: Digi-Key; Manufacturer Part Number: RC0402FR-07150RL; RoHS: Yes; Category: Chip SMD Resistors; Stock 1: 5214533; Pricing 1: 1=0.10000, 10=0.01400, 100=0.00580, 1000=0.00260, 2500=0.00226, 5000=0.00186 (USD); Case/Package: 0402; Case Code (Metric): 1005; Min Operating Temperature: -55°C; Max Operating Temperature: 155°C; Packaging: Tape and Reel; Package Quantity: 1; Resistor Type: Thick Film; Number of Terminations: 2; Termination: SMD/SMT; Working Voltage: 50V; Features: Moisture Resistant; Series: RC; Resistance Tolerance: 1%; Construction: Rectangular; Technology: THICK FILM; Length: 1mm; Width: 0.02inch; Height: 0.016inch; Depth: 0.5mm; REACH SVHC: No SVHC; Military Standard: Not; Lead Free: Lead Free; RoHS Compliant: Yes; ComponentLink1URL: https://datasheet.ciiva.com/11808/0900766b80c66297-11808422.pdf; ComponentLink1Description: ine datasheet; Supplier 2: Mouser; Stock 2: 582717; Pricing 2: 1=0.10000, 10=0.01200, 50=0.01200, 100=0.00400, 1000=0.00400, 10000=0.00300 (USD); Supplier 3: Farnell; Stock 3: 880000; Pricing 3: 10000=0.00270, 50000=0.00200 (GBP); Created by: D. Gakure; Checked By: ?; Supplier Part Number 3: 2421893; Supplier Part Number 2: 603-RC0402FR-07150RL; Supplier Part Number 1: 311-150LRCT-ND; Tolerance: 1%; Case Code (Imperial): 0402
R7 = RC0402FR-071ML: RES SMD 1M OHM 1% 1/16W 0402; Manufacturer: Yageo; Power Rating: 63mW; Voltage Rating: 50V; Temperature Coefficient: 100ppm/°C; Supplier 1: Digi-Key; Manufacturer Part Number: RC0402FR-071ML; RoHS: Yes; Category: Chip SMD Resistors; Stock 1: 7856490; Pricing 1: 1=0.10000, 10=0.01600, 100=0.00640, 1000=0.00286, 2500=0.00248, 5000=0.00205 (USD); Case/Package: 0402; Case Code (Metric): 1005; Size Code: 0402; Min Operating Temperature: -55°C; Max Operating Temperature: 155°C; Resistor Type: Thick Film; Packaging: Tape and Reel; Termination: SMD/SMT; Features: Moisture Resistant; Series: RC; Max Power Dissipation: 63mW; Number of Terminations: 2; Resistance Tolerance: 1%; Construction: Rectangular; Technology: THICK FILM; Length: 1mm; Height: 0.32mm; Depth: 0.5mm; RoHS Compliant: Yes; REACH SVHC: Unknown; Military Standard: Not; Lead Free: Lead Free; ComponentLink1URL: https://datasheet.ciiva.com/11808/0900766b80c66297-11808125.pdf; ComponentLink1Description: Online datasheet; Supplier 2: Mouser; Stock 2: 1194490; Pricing 2: 1=0.10000, 10=0.01200, 50=0.01200, 100=0.00400, 1000=0.00400, 10000=0.00300 (USD); Supplier 3: Farnell; Stock 3: 1530000; Pricing 3: 10000=0.00290, 50000=0.00200 (GBP); Created By: D. Gakure; Supplier Part Number 2: 603-RC0402FR-071ML; Supplier Part Number 1: 311-1.00MLRCT-ND; Checked By: ?; Supplier Part Number 3: 2421892; Tolerance: 1%
R11 = CRGP0805F100R: 100 Ohms ±1% 0.333W, 1/3W Chip Resistor 0805 (2012 Metric) Pulse Withstanding Thick Film; Manufacturer: TE Connectivity; Temperature Coefficient: 200ppm/°C; Supplier 1: Digi-Key; Manufacturer Part Number: CRGP0805F100R; RoHS: Yes; Category: Chip SMD Resistors; Stock 1: 6960; Pricing 1: 1=0.21000, 10=0.17600, 100=0.06870, 1000=0.02877, 2500=0.02637 (USD); Case/Package: 0805; Case Code (Imperial): 0805; Case Code (Metric): 2012; Min Operating Temperature: -55°C; Max Operating Temperature: 155°C; Resistor Type: Thick Film; Packaging: Cut Tape; Number of Terminations: 2; RoHS Compliant: Yes; ComponentLink1URL: https://www.te.com/commerce/DocumentDelivery/DDEController?Action=showdoc&DocId=Data+Sheet%7F9-1773463-9%7FA%7Fpdf%7FEnglish%7FENG_DS_9-1773463-9_A.pdf%7F1-2176327-3; ComponentLink1Description: Online datasheet; Supplier 2: Mouser; Stock 2: 4703; Pricing 2: 1=0.20000, 10=0.17500, 50=0.17500, 100=0.06800, 1000=0.02600, 10000=0.02000 (USD); Supplier 3: Farnell; Stock 3: 3670; Pricing 3: 10=0.14300, 100=0.06350, 500=0.04220, 1000=0.02090, 2500=0.01980, 5000=0.01650, 25000=0.01440 (GBP); Supplier Part Number 3: 2861083; Supplier Part Number 2: 279-CRGP0805F100R; Supplier Part Number 1: A130465CT-ND; Created By: D. Gakure; Checked By: ?
R12 = RC0402FR-0752K3L: RES SMD 52.3K OHM 1% 1/16W 0402; Manufacturer: Yageo; Temperature Coefficient: 100ppm/°C; Power Rating: 62.5mW; Voltage Rating: 50V; Max Power Dissipation: 63mW; Supplier 1: Digi-Key; Manufacturer Part Number: RC0402FR-0752K3L; RoHS: Yes; Category: Chip SMD Resistors; Stock 1: 1178310; Pricing 1: 1=0.10000, 10=0.01600, 100=0.00640, 1000=0.00286, 2500=0.00248, 5000=0.00205 (USD); Case/Package: 0402; Contact Plating: Tin,Matte; Weight: 2.3E-05oz; Min Operating Temperature: -55°C; Max Operating Temperature: 155°C; Resistor Type: Thick Film; Packaging: Tape and Reel; Number of Terminations: 2; Termination: SMD/SMT; Voltage Rating (DC): 50V; Features: Moisture Resistant; Series: RC; Construction: Rectangular; Length: 1mm; Width: 0.02inch; Height: 0.016inch; Depth: 0.5mm; Military Standard: Not; Lead Free: Lead Free; RoHS Compliant: Yes; ComponentLink1URL: https://datasheet.ciiva.com/16867/pyu-rc0402-51-rohs-l-6-16867930.pdf; ComponentLink1Description: Oline datasheet; Supplier 2: Mouser; Stock 2: 83620; Pricing 2: 1=0.10000, 10=0.01200, 50=0.01200, 100=0.00400, 1000=0.00300, 10000=0.00300 (USD); Created By: D. Gakure; Checked By: ?; Supplier Part Number 2: 603-RC0402FR-0752K3L; Supplier Part Number 1: YAG3179CT-ND; Size Code: 0402; Case Code (Metric): 1005
R13#2 R16 R17 = RC0402FR-071KL: RES SMD 1K OHM 1% 1/16W 0402; Manufacturer: Yageo; Temperature Coefficient: 100ppm/°C; Voltage Rating (DC): 50V; Power Rating: 62.5mW; Supplier 1: Digi-Key; Manufacturer Part Number: RC0402FR-071KL; RoHS: Yes; Category: Resistors; Stock 1: 37591306; Pricing 1: 1=0.10000, 10=0.01400, 100=0.00580, 1000=0.00262, 2500=0.00228, 5000=0.00188 (USD); Case/Package: 0402; Number of Pins: 2; Case Code (Imperial): 0402; Case Code (Metric): 1005; Min Operating Temperature: -55°C; Max Operating Temperature: 155°C; Resistor Type: Thick Film; Tolerance: 1%; Packaging: Tape and Reel; Voltage Rating: 50V; Termination: SMD/SMT; Length: 1mm; Height: 0.32mm; Width: 0.5mm; Depth: 0.5mm; REACH SVHC: Unknown; Lead Free: Lead Free; Military Standard: Not; ComponentLink2URL: https://datasheet.ciiva.com/12666/pyu-rc0402-51-rohs-l-6-r-12666741.pdf; ComponentLink2Description: Online datasheet; Supplier 2: Mouser; Stock 2: 11912978; Pricing 2: 1=0.10000, 10=0.01200, 100=0.00400, 1000=0.00400, 2500=0.00400, 10000=0.00300 (USD); Supplier 3: Farnell; Stock 3: 29900; Pricing 3: 1=0.08130, 25=0.01210, 100=0.01120, 250=0.01030, 500=0.00900 (GBP); Supplier Part Number 3: 2132441; Supplier Part Number 2: 603-RC0402FR-071KL; Supplier Part Number 1: 311-1.00KLRDKR-ND; Created: D.G; Checked: ?
R14 = RT0402FRE0768KL: RES SMD 68K OHM 1% 1/16W 0402; Manufacturer: Yageo; Temperature Coefficient: 50ppm/°C; Power Rating: 62.5mW; Voltage Rating: 50V; Max Power Dissipation: 63mW; Supplier 1: Digi-Key; RoHS: Yes; Category: Chip SMD Resistors; Stock 1: 19319; Pricing 1: 1=0.10000, 10=0.07000, 100=0.02830, 1000=0.01272, 2500=0.01104, 5000=0.00912 (USD); Case/Package: 0402; Contact Plating: Tin,Matte; Case Code (Metric): 1005; Min Operating Temperature: -55°C; Max Operating Temperature: 125°C; Resistor Type: Thin Film; Package Quantity: 10000; Packaging: Tape and Reel; Number of Terminations: 2; Termination: SMD/SMT; Voltage Rating (DC): 50V; Series: RT; Length: 0.039inch; Width: 0.02inch; Height: 0.014inch; Radiation Hardening: No; Lead Free: Lead Free; RoHS Compliant: Yes; ComponentLink1URL: https://datasheet.ciiva.com/2561/pyu-rt-1-to-0-05-rohs-l-5-2561824.pdf?src-supplier=Digi-Key; ComponentLink1Description: Online datasheet; Supplier 2: Mouser; Stock 2: 28756; Pricing 2: 1=0.24000, 10=0.05600, 50=0.05600, 100=0.01900, 1000=0.01400, 10000=0.00800 (USD); Created By: D. Gakure; Checked By: ?; Supplier Part Number 2: 603-RT0402FRE0768KL; Supplier Part Number 1: 13-RT0402FRE0768KLCT-ND; Manufacturer Part Number: RT0402FRE0768KL
R15 = RC0402FR-07100KL: RES SMD 100K OHM 1% 1/16W 0402; Manufacturer: Yageo; Temperature Coefficient: 100ppm/°C; Power Rating: 63mW; Voltage Rating: 50V; Supplier 1: Digi-Key; Manufacturer Part Number: RC0402FR-07100KL; RoHS: Yes; Category: Resistors; Stock 1: 5819191; Pricing 1: 1=0.10000, 10=0.01400, 100=0.00580, 1000=0.00262, 2500=0.00228, 5000=0.00188 (USD); Case Code (Metric): 1005; Case Code (Imperial): 0402; Min Operating Temperature: -55°C; Max Operating Temperature: 155°C; Resistor Type: Thick Film; Packaging: Tape and Reel; Package Quantity: 1; Number of Terminations: 2; Termination: SMD/SMT; Max Power Dissipation: 63mW; Working Voltage: 50V; Features: Moisture Resistant; Length: 0.039inch; Height: 0.016inch; Width: 0.02inch; Depth: 0.5mm; REACH SVHC: No SVHC; Lead Free: Lead Free; Military Standard: Not; ComponentLink2URL: https://datasheet.ciiva.com/2453/pyu-r-int-thick-7-2453361.pdf; ComponentLink2Description: Online datasheet; Supplier 2: Mouser; Stock 2: 4458847; Pricing 2: 1=0.10000, 10=0.01200, 100=0.00400, 1000=0.00400, 2500=0.00400, 10000=0.00300 (USD); Supplier 3: Farnell; Stock 3: 19392; Pricing 3: 1=0.10200, 25=0.01220, 100=0.01200, 250=0.01020, 500=0.00890 (GBP); Created By: DG; Checked By: ?; Supplier Part Number 3: 2131798; Supplier Part Number 1: 311-100KLRCT-ND; Supplier Part Number 2: 603-RC0402FR-07100KL
TP1 TP2 = TestPoint: Test Point
U1 = NCP114ASN330T1G: ON SEMICONDUCTOR - NCP114ASN330T1G - LDO Voltage Regulator, Fixed, 1.7 V to 5.5 V in, 3.3 V/300 mA out, 150 mV drop, TSOP-5; Output Current: 300mA; Output Configuration: Positive; Number of Regulators: 1; Max Input Voltage: 5.5V; Min Output Voltage: 3.3V; Dropout Voltage: 225mV; Quiescent Current: 95uA; Power Supply Rejection Ratio (PSRR): 75dB; Supplier 1: Digi-Key; RoHS: No; Category: Voltage Regulators - Linear; Stock 1: 32529; Pricing 1: 1=0.33000, 10=0.24900, 25=0.21760, 100=0.12440, 250=0.11664, 500=0.09330, 1000=0.07153 (USD); Mount: Surface Mount; Case/Package: SOT-23-5; Min Operating Temperature: -40°C; Max Operating Temperature: 85°C; Output Type: Fixed; Packaging: Cut Tape; Lead Free: Lead Free; ComponentLink3URL: http://www.onsemi.com/pub/Collateral/NCP114-D.PDF; ComponentLink3Description: On Semi datasheet online; Supplier 2: RSComponents; Supplier 3: Mouser; Supplier Part Number 3: 863-NCP114ASN330T1G; Supplier Part Number 2: 1263178; Supplier Part Number 1: NCP114ASN330T1GOSCT-ND; Created: DG; Checked: ?; Manufacturer: ON Semiconductor; Manufacturer Part Number: NCP114ASN330T1G
U2 = TPS2553DBVR: POWER LOAD SWITCH, HIGH SIDE, SOT-23-6; Power Load Switch Type:High Side; Input Voltage:6.5V; Current Limit:1.7A; On State Resistance:0.085ohm; Distribution Switch Case Style:SOT-23; No. of Pins:6; Thermal Protection:Yes; On / Enable;RoHS Compliant: Yes; Manufacturer 1: Texas Instruments; Number of Outputs: 1; Min Supply Voltage: 2.5V; Max Supply Voltage: 6.5V; On-State Resistance: 85mR; Output Current: 1.5A; Max Power Dissipation: 625mW; Supplier 1: Digi-Key; RoHS: Yes; Category: Hot Swap Controllers; Stock 1: 14713; Pricing 1: 1=1.20000, 10=1.07100, 25=1.01640, 100=0.78050, 250=0.68972, 500=0.65340, 1000=0.50820 (USD); Case/Package: SOT-23; Number of Pins: 6; Weight: 0.00127oz; Min Operating Temperature: -40°C; Max Operating Temperature: 85°C; Packaging: Tape and Reel; Package Quantity: 1; Max Input Voltage: 6.5V; Min Input Voltage: 2.5V; Radiation Hardening: No; Lead Free: Lead Free; REACH SVHC: No SVHC; ComponentLink1URL: https://datasheet.ciiva.com/15108/getdatasheetpartid-297517-15108509.pdf?src-supplier=Verical; ComponentLink1Description: https://datasheet.ciiva.com/15108/getdatasheetpartid-297517-15108509.pdf?src-supplier=Verical; Supplier 2: Farnell; Supplier 3: Mouser; Supplier Part Number 3: 595-TPS2553DBVR; Supplier Part Number 2: 3124082; Supplier Part Number 1: 296-32464-1-ND; Manufacturer Part Number 1: TPS2553DBVR
U3 = ST STM32F030F4P6: STMICROELECTRONICS - STM32F030F4P6 - 32 Bit Microcontroller, Value Line, ARM Cortex-M0, 48 MHz, 16 KB, 4 KB, 20, TSSOP RoHS Compliant: Yes; Max Supply Voltage: 3.6V; Frequency: 48MHz; Interface: I2C,SPI,UART,USART; RAM Size: 4KB; Max Power Dissipation: 182mW; Number of I/Os: 15; Number of Timers/Counters: 5; Min Supply Voltage: 2.4V; Number of ADC Channels: 16; Oscillator Type: Internal; Data Bus Width: 32b; Number of SPI Channels: 1; Memory Type: FLASH; Memory Size: 16KB; Peripherals: POR,PWM,WDT,DMA; Number of PWM Channels: 6; Categories: Integrated Circuits; Supplier 1: Farnell; Manufacturer: STMicroelectronics; RoHS: Yes; Category: Microcontrollers; Stock 1: 1196; Pricing 1: 1=0.97500, 25=0.85400, 50=0.75500, 100=0.65600, 250=0.61800, 500=0.58000, 1000=0.52500, 2500=0.46900 (GBP); Case/Package: TSSOP; Number of Pins: 20; Contact Plating: Gold; Min Operating Temperature: -40°C; Max Operating Temperature: 85°C; Package Quantity: 74; Packaging: Rail/Tube; Number of Programmable I/O: 15; Max Frequency: 48MHz; Number of I2C Channels: 1; Watchdog Timer: Yes; Core Architecture: ARM; Length: 6.6mm; Height: 1.05mm; Width: 4.5mm; Radiation Hardening: No; REACH SVHC: No SVHC; Lead Free: Lead Free; ComponentLink1URL: https://datasheet.ciiva.com/29720/dm00088500-29720640.pdf; ComponentLink1Description: Online datasheet; Supplier Part Number 1: 2393635; Created: DG; Checked: ?; Supplier Part Number 2: 497-14044-5-ND; Supplier 2: Digi-Key; Supplier 3: RSComponents; Stock 3: 48; Pricing 3: 100=0.43900, 250=0.38800, 1000=0.37300 (GBP); Supplier Part Number 3: 7925925P; Manufacturer Part Number: STM32F030F4P6